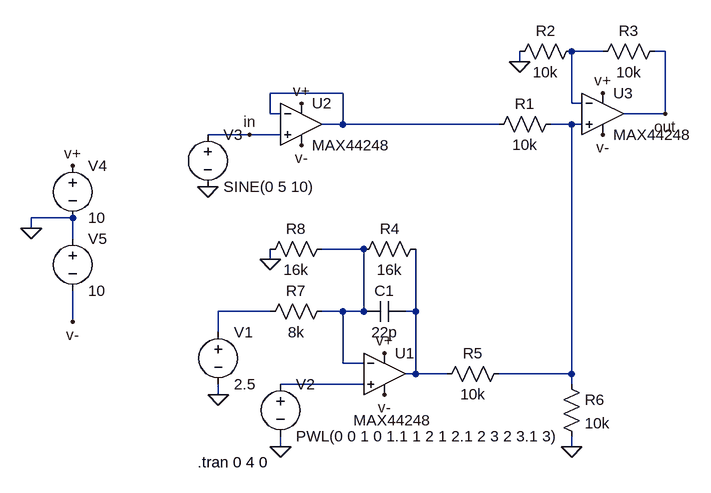
[diagram p0: schematic regulowany_offset.asc]
regulowany_offset.asc, the LTspice schematic file:
Version 4
SHEET 1 880 808
WIRE 192 80 144 80
WIRE 288 80 272 80
WIRE 64 96 64 80
WIRE -208 144 -320 144
WIRE 144 160 144 80
WIRE 160 160 144 160
WIRE -320 176 -320 144
WIRE -304 176 -320 176
WIRE 288 176 288 80
WIRE 288 176 224 176
WIRE -208 192 -208 144
WIRE -208 192 -240 192
WIRE 32 192 -208 192
WIRE 144 192 112 192
WIRE 160 192 144 192
WIRE -352 208 -416 208
WIRE -304 208 -352 208
WIRE -624 336 -688 336
WIRE -688 352 -688 336
WIRE -624 368 -624 336
WIRE -176 384 -240 384
WIRE -320 400 -320 384
WIRE -320 480 -400 480
WIRE -208 480 -240 480
WIRE -176 480 -176 384
WIRE -176 480 -208 480
WIRE -96 480 -96 384
WIRE -96 480 -112 480
WIRE -624 496 -624 448
WIRE -400 512 -400 480
WIRE -208 560 -208 480
WIRE -176 560 -208 560
WIRE -96 576 -96 480
WIRE -96 576 -112 576
WIRE -48 576 -96 576
WIRE 144 576 144 192
WIRE 144 576 32 576
WIRE -176 592 -304 592
WIRE 144 592 144 576
WIRE -400 608 -400 592
WIRE -304 688 -304 672
WIRE 144 688 144 672
FLAG 64 96 0
FLAG 144 688 0
FLAG -320 400 0
FLAG -304 688 0
FLAG -400 608 0
FLAG -416 288 0
FLAG 192 144 v+
FLAG -144 544 v+
FLAG 192 208 v-
FLAG -144 608 v-
FLAG -624 256 v+
FLAG -624 496 v-
FLAG -272 160 v+
FLAG -272 224 v-
FLAG -688 352 0
FLAG 288 176 out
FLAG -352 208 in
SYMBOL res 128 176 R90
WINDOW 0 0 56 VBottom 2
WINDOW 3 32 56 VTop 2
SYMATTR InstName R1
SYMATTR Value 10k
SYMBOL res 160 64 R90
WINDOW 0 0 56 VBottom 2
WINDOW 3 32 56 VTop 2
SYMATTR InstName R2
SYMATTR Value 10k
SYMBOL res 288 64 R90
WINDOW 0 0 56 VBottom 2
WINDOW 3 32 56 VTop 2
SYMATTR InstName R3
SYMATTR Value 10k
SYMBOL cap -112 464 R90
WINDOW 0 0 32 VBottom 2
WINDOW 3 32 32 VTop 2
SYMATTR InstName C1
SYMATTR Value 22p
SYMATTR SpiceLine V=10 Irms=0 Rser=0.3162 Lser=288p mfg="Würth Elektronik" pn="885012005009 WCAP-CSGP 0402" type="NP0"
SYMBOL res -80 368 R90
WINDOW 0 0 56 VBottom 2
WINDOW 3 32 56 VTop 2
SYMATTR InstName R4
SYMATTR Value 16k
SYMBOL res 48 560 R90
WINDOW 0 0 56 VBottom 2
WINDOW 3 32 56 VTop 2
SYMATTR InstName R5
SYMATTR Value 10k
SYMBOL res 128 576 R0
SYMATTR InstName R6
SYMATTR Value 10k
SYMBOL res -224 464 R90
WINDOW 0 0 56 VBottom 2
WINDOW 3 32 56 VTop 2
SYMATTR InstName R7
SYMATTR Value 8k
SYMBOL res -224 368 R90
WINDOW 0 0 56 VBottom 2
WINDOW 3 32 56 VTop 2
SYMATTR InstName R8
SYMATTR Value 16k
SYMBOL voltage -400 496 R0
WINDOW 123 0 0 Left 0
WINDOW 39 0 0 Left 0
SYMATTR InstName V1
SYMATTR Value 2.5
SYMBOL voltage -304 576 R0
WINDOW 123 0 0 Left 0
WINDOW 39 0 0 Left 0
SYMATTR InstName V2
SYMATTR Value PWL(0 0 1 0 1.1 1 2 1 2.1 2 3 2 3.1 3)
SYMBOL voltage -416 192 R0
WINDOW 123 24 124 Left 2
WINDOW 39 0 0 Left 0
SYMATTR InstName V3
SYMATTR Value SINE(0 5 10)
SYMBOL voltage -624 240 R0
WINDOW 123 0 0 Left 0
WINDOW 39 0 0 Left 0
SYMATTR InstName V4
SYMATTR Value 10
SYMBOL OpAmps\\MAX44248 -144 512 R0
WINDOW 3 -48 135 Left 2
SYMATTR InstName U1
SYMBOL OpAmps\\MAX44248 -272 128 R0
SYMATTR InstName U2
SYMBOL OpAmps\\MAX44248 192 112 R0
SYMATTR InstName U3
SYMBOL voltage -624 352 R0
WINDOW 123 0 0 Left 0
WINDOW 39 0 0 Left 0
SYMATTR InstName V5
SYMATTR Value 10
TEXT -432 712 Left 2 !.tran 0 4 0

The netlist it stands for:
* regulowany_offset.asc
R1 N003 N002 10k
R2 N001 0 10k
R3 out N001 10k
C1 N006 N004 22p V=10 Irms=0 Rser=0.3162 Lser=288p mfg="Würth Elektronik" pn="885012005009 WCAP-CSGP 0402" type="NP0"
R4 N006 N004 16k
R5 N003 N006 10k
R6 N003 0 10k
R7 N004 N005 8k
R8 N004 0 16k
V1 N005 0 2.5
V2 N007 0 PWL(0 0 1 0 1.1 1 2 1 2.1 2 3 2 3.1 3)
V3 in 0 SINE(0 5 10)
V4 v+ 0 10
XU1 N007 N004 v+ v- N006 MAX44248  ; pins In+ In- V+ V- OUT
XU2 in N002 v+ v- N002 MAX44248  ; pins In+ In- V+ V- OUT
XU3 N003 N001 v+ v- out MAX44248  ; pins In+ In- V+ V- OUT
V5 0 v- 10
.tran 0 4 0
.backanno
.end